# EAGLE schematic linefollower (EAGLE 9.3.2)
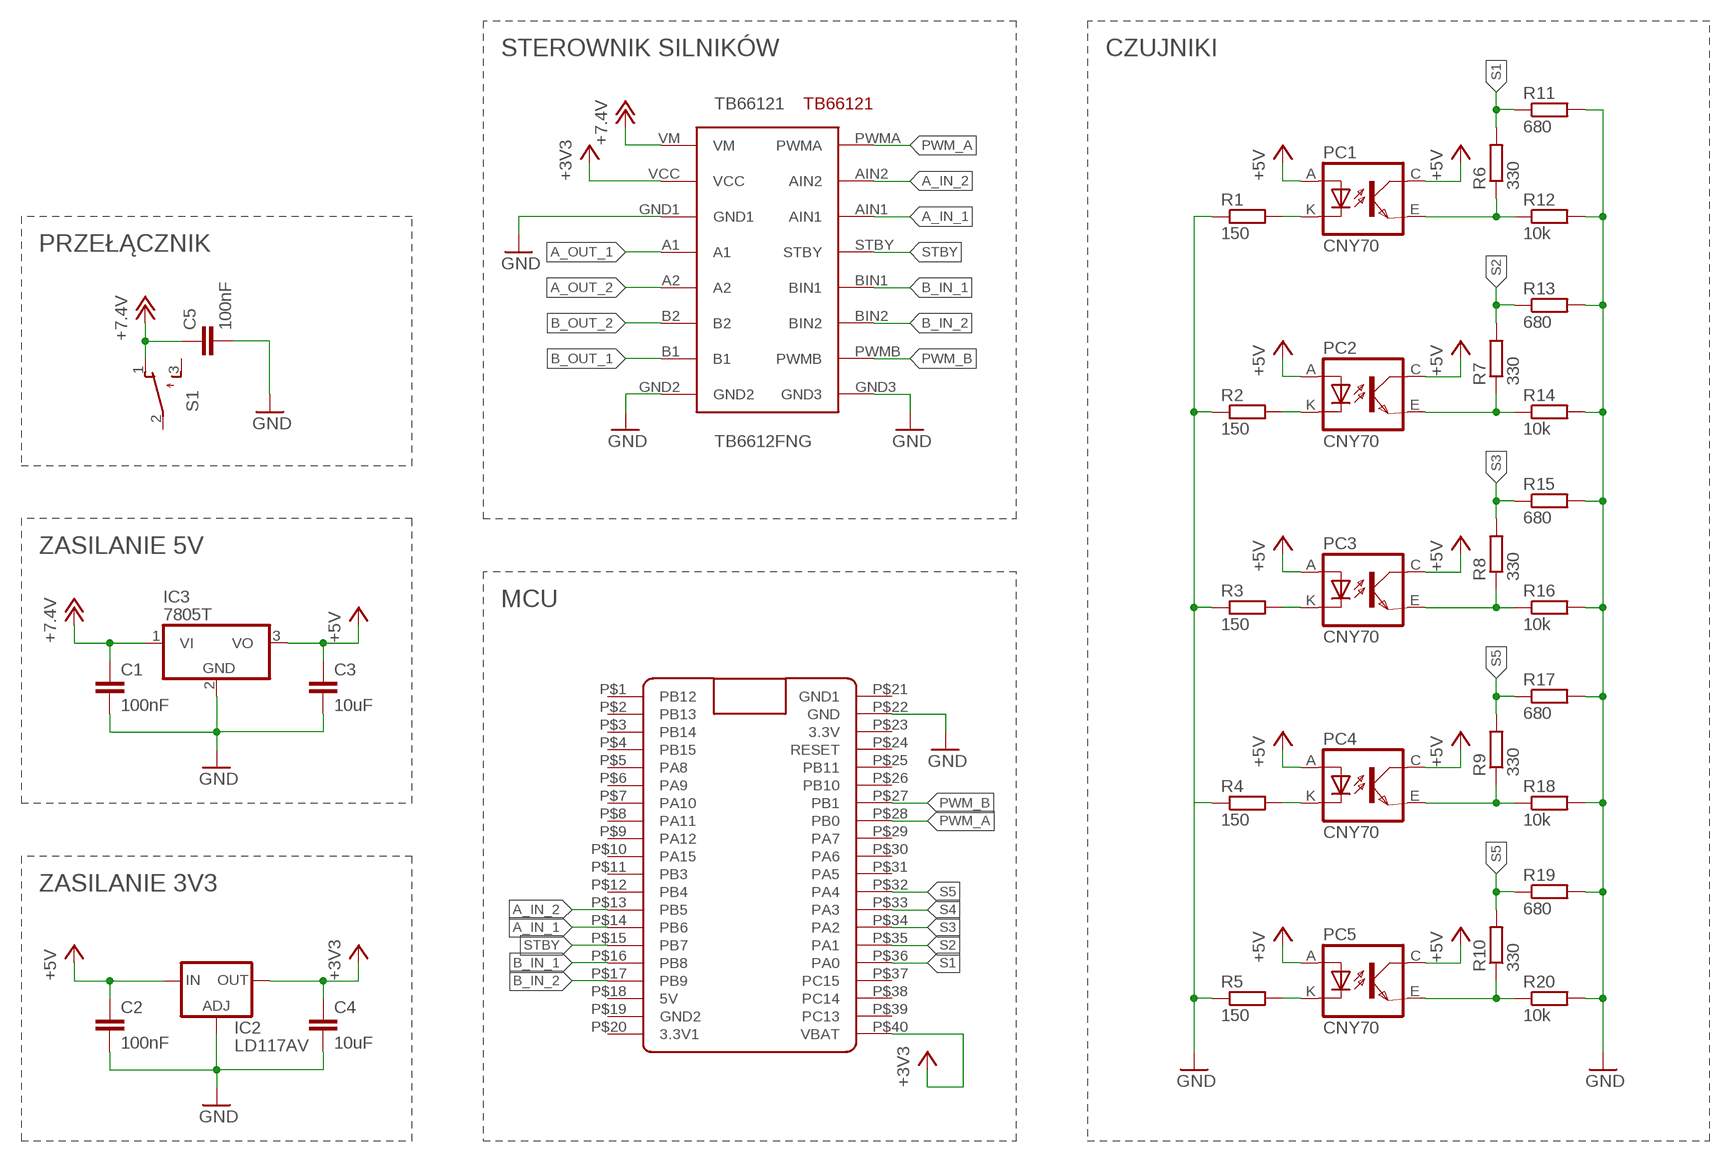
[diagram p0: schematic, sheet 1]

## Parts
C1  100nF  C-EU025-024X044  [C025-024X044]
C2  100nF  C-EU025-024X044  [C025-024X044]
C3  10uF  C-EU025-024X044  [C025-024X044]
C4  10uF  C-EU025-024X044  [C025-024X044]
C5  100nF  C-EU025-024X044  [C025-024X044]
IC2  LD117AV  [TO220L1]
IC3  7805T  [TO220H]
PC1  CNY70  [4]
PC2  CNY70  [4]
PC3  CNY70  [4]
PC4  CNY70  [4]
PC5  CNY70  [4]
R1  150  R-EU_0204/5  [0204/5]
R2  150  R-EU_0204/5  [0204/5]
R3  150  R-EU_0204/5  [0204/5]
R4  150  R-EU_0204/5  [0204/5]
R5  150  R-EU_0204/5  [0204/5]
R6  330  R-EU_0204/5  [0204/5]
R7  330  R-EU_0204/5  [0204/5]
R8  330  R-EU_0204/5  [0204/5]
R9  330  R-EU_0204/5  [0204/5]
R10  330  R-EU_0204/5  [0204/5]
R11  680  R-EU_0204/5  [0204/5]
R12  10k  R-EU_0204/5  [0204/5]
R13  680  R-EU_0204/5  [0204/5]
R14  10k  R-EU_0204/5  [0204/5]
R15  680  R-EU_0204/5  [0204/5]
R16  10k  R-EU_0204/5  [0204/5]
R17  680  R-EU_0204/5  [0204/5]
R18  10k  R-EU_0204/5  [0204/5]
R19  680  R-EU_0204/5  [0204/5]
R20  10k  R-EU_0204/5  [0204/5]
S1  TL32PO  [TL3XPO]
ST1  BLUE_PILL  [BLUE_PILL]
TB66121  TB6612FNG  [TB6612FNG]

## Nets
+3V3: C4.1 IC2.2(OUT) ST1.P$40(VBAT) TB66121.VCC
+5V: C2.1 C3.1 IC2.3(IN) IC3.3(VO) PC1.A PC1.C(COL) PC2.A PC2.C(COL) PC3.A PC3.C(COL) PC4.A PC4.C(COL) PC5.A PC5.C(COL)
+12V: C1.1 C5.1 IC3.1(VI) S1.1(O) TB66121.VM ; supply symbol labelled +7.4V
A_IN_1: ST1.P$14(PB6) TB66121.AIN1
A_IN_2: ST1.P$13(PB5) TB66121.AIN2
A_OUT_1: TB66121.A1
A_OUT_2: TB66121.A2
B_IN_1: ST1.P$16(PB8) TB66121.BIN1
B_IN_2: ST1.P$17(PB9) TB66121.BIN2
B_OUT_1: TB66121.B1
B_OUT_2: TB66121.B2
GND: C1.2 C2.2 C3.2 C4.2 C5.2 IC2.1(ADJ) IC3.2(GND) R1.1 R2.1 R3.1 R5.1 R11.2 R12.2 R13.2 R14.2 R15.2 R16.2 R17.2 R18.2 R19.2 R20.2 ST1.P$22(GND) TB66121.GND1 TB66121.GND2 TB66121.GND3
GND1: R4.1
N$1: PC1.K(C) R1.2
N$2: PC2.K(C) R2.2
N$3: PC3.K(C) R3.2
N$4: PC5.K(C) R5.2
N$5: PC4.K(C) R4.2
PWM_A: ST1.P$28(PB0) TB66121.PWMA
PWM_B: ST1.P$27(PB1) TB66121.PWMB
S1: PC1.E(EMI) R6.1 R6.2 R11.1 R12.1 ST1.P$36(PA0)
S2: PC2.E(EMI) R7.1 R7.2 R13.1 R14.1 ST1.P$35(PA1)
S3: PC3.E(EMI) R8.1 R8.2 R15.1 R16.1 ST1.P$34(PA2)
S4: ST1.P$33(PA3)
S5: PC4.E(EMI) PC5.E(EMI) R9.1 R9.2 R10.1 R10.2 R17.1 R18.1 R19.1 R20.1 ST1.P$32(PA4)
STBY: ST1.P$15(PB7) TB66121.STBY
Unconnected: S1.2(P) S1.3(S) ST1.P$1(PB12) ST1.P$2(PB13) ST1.P$3(PB14) ST1.P$4(PB15) ST1.P$5(PA8) ST1.P$6(PA9) ST1.P$7(PA10) ST1.P$8(PA11) ST1.P$9(PA12) ST1.P$10(PA15) ST1.P$11(PB3) ST1.P$12(PB4) ST1.P$18(5V) ST1.P$19(GND2) ST1.P$20(3.3V1) ST1.P$23(3.3V) ST1.P$24(RESET) ST1.P$25(PB11) ST1.P$26(PB10) ST1.P$29(PA7) ST1.P$30(PA6) ST1.P$31(PA5) ST1.P$37(PC15) ST1.P$38(PC14) ST1.P$39(PC13)

## Notes on the sheet
- STEROWNIK SILNIKÓW | CZUJNIKI
- PRZEŁĄCZNIK
- ZASILANIE 5V
- MCU
- ZASILANIE 3V3

## Power pins joined to a net without a drawn wire
GND1: ST1.P$21(GND1)

## Library data of the parts
C1-C5 = resistor:C-EU: CAPACITOR, European symbol
IC2 = v-reg:LD117A?*: Low drop fixed and adjustable positive voltage regulators 1 A Source: http://www.st.com/stonline/products/literature/ds/7194/ld1117axx.pdf
IC3 = linear:78*: Positive VOLTAGE REGULATOR Source: http://cache.national.com/ds/LM/LM78L05.pdf http://www.fairchildsemi.com/ds/LM/LM7805.pdf
PC1-PC5 = cny70:CNY70
R1-R20 = resistor:R-EU_: RESISTOR, European symbol
S1 = switch:TL32PO: TINY SWITCH ON - MOM Source: http://www2.produktinfo.conrad.com/datenblaetter/700000-724999/705152-da-01-de-Subminiaturschalter_TL_36YO.pdf
ST1 = BluePill:BLUE_PILL
TB66121 = TB6612FNG:TB6612FNG